# Altium schematic sheet 24V_Main_Regulator.SchDoc (part 2 of 5)
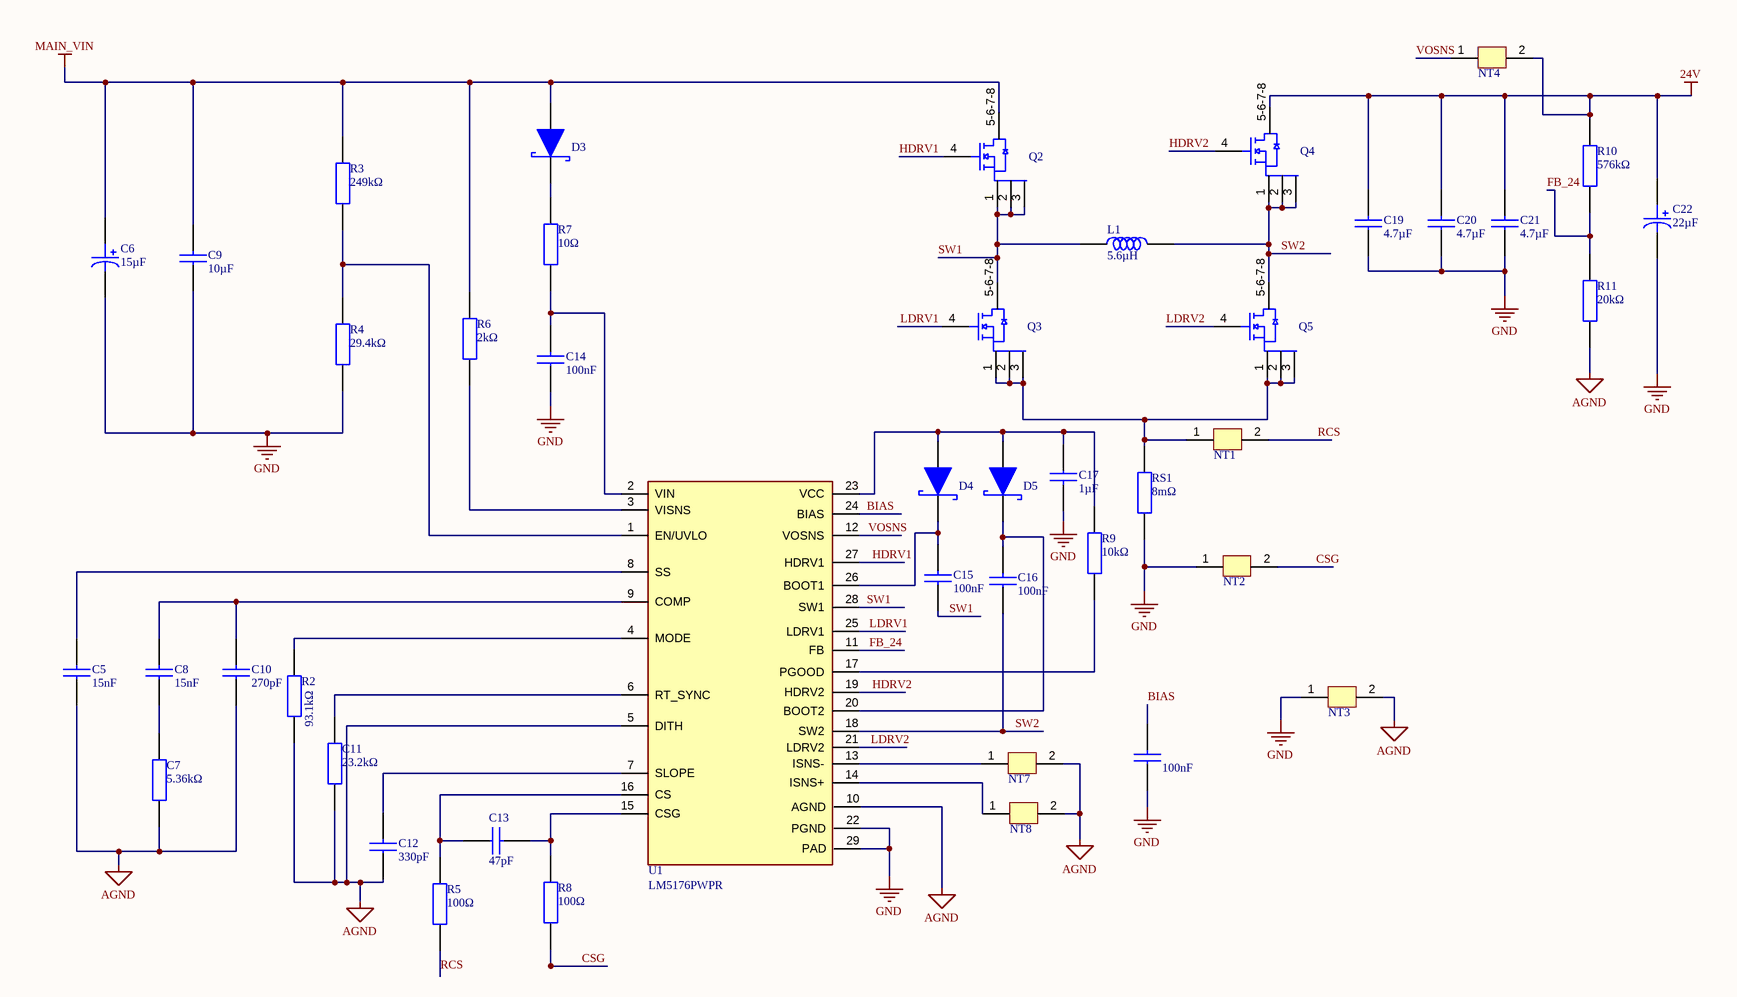
[diagram p1: 24V_Main_Regulator.SchDoc]
## Library data of the parts
C5 = C0603C153J3GACTU: 0603 C 15NF Ceramic Multilayer Capacitor, 25 V, +125DEGC, C0G Dielectric, +/-5%; Manufacturer: Yageo Group; Dissipation Factor: 0.1%; Temperature Coefficient: 30ppm/°C; Tolerance: 5%; Voltage: 25V; Supplier: Farnell; Supplier Part Number: C0603C153J3GACTU; Manufacturer Part Number: C0603C153J3GACTU; RoHS: Compliant; Category: Ceramic Capacitors; Stock: 31000; Pricing: 4000=0,0675 (EUR); Case/Package: 0603; Case Code (Imperial): 0603; Case Code (Metric): 1608; China RoHS: Compliant; Contact Plating: Tin; Country of Origin: Mexico; Depth: 800µm; Dielectric: C0G; Dielectric Material: Ceramic; Export Control Classification Number (ECCN) Code: EAR99; Height: 800µm; Harmonized Tariff Schedule (HTS) Code: 8532.24.00.20; Introduction Date: 2008-06-06; Lead Free: Lead Free; Length: 1.6mm; Lifecycle Status: Production; Material: Ceramic; Max Operating Temperature: 125°C; Min Operating Temperature: -55°C; Mounting Technology: Surface Mount; Pins: 2; Number of Terminals: 2; Packaging: Cut Tape; REACH SVHC: Yes; Schedule B: 8532240020, 8532240020|8532240020, 8532240020|8532240020|8532240020, 8532240020|8532240020|8532240020|8532240020; Termination: SMD/SMT; Thickness: 863.6µm; Voltage Rating: 25V; Voltage Rating (DC): 25V; Width: 800µm; ComponentLink1URL: https://datasheet.octopart.com:443/C0603C153J3GACTU-KEMET-datasheet-178132257.pdf?src-supplier=IHS; ComponentLink1Description: https://datasheet.octopart.com:443/C0603C153J3GACTU-KEMET-datasheet-178132257.pdf?src-supplier=IHS; ComponentLink2URL: https://datasheet.octopart.com:443/C0603C153J3GAC7867-KEMET-datasheet-10540709.pdf?src-supplier=IHS; ComponentLink2Description: https://datasheet.octopart.com:443/C0603C153J3GAC7867-KEMET-datasheet-10540709.pdf?src-supplier=IHS; ComponentLink3URL: https://datasheet.octopart.com:443/C0603C153J3GACTU-KEMET-datasheet-137357764.pdf?src-supplier=Upverter; ComponentLink3Description: https://datasheet.octopart.com:443/C0603C153J3GACTU-KEMET-datasheet-137357764.pdf?src-supplier=Upverter; ComponentLink4URL: https://datasheet.octopart.com:443/C0603C153J3GACTU-KEMET-datasheet-68331921.pdf?src-supplier=Farnell; ComponentLink4Description: https://datasheet.octopart.com:443/C0603C153J3GACTU-KEMET-datasheet-68331921.pdf?src-supplier=Farnell; ComponentLink5URL: https://datasheet.octopart.com:443/C0603C153J3GACTU-KEMET-datasheet-102648314.pdf?src-supplier=Farnell; ComponentLink5Description: https://datasheet.octopart.com:443/C0603C153J3GACTU-KEMET-datasheet-102648314.pdf?src-supplier=Farnell; ComponentLink6URL: https://datasheet.octopart.com:443/C0603C153J3GACTU-Kemet-datasheet-5308203.pdf?src-supplier=Farnell; ComponentLink6Description: https://datasheet.octopart.com:443/C0603C153J3GACTU-Kemet-datasheet-5308203.pdf?src-supplier=Farnell; ComponentLink7URL: https://datasheet.octopart.com:443/C0603C153J3GACTU-KEMET-datasheet-176289261.pdf?src-supplier=element14+APAC; ComponentLink7Description: https://datasheet.octopart.com:443/C0603C153J3GACTU-KEMET-datasheet-176289261.pdf?src-supplier=element14+APAC; ComponentLink8URL: https://datasheet.octopart.com:443/C0603C153J3GACTU-KEMET-datasheet-178087916.pdf?src-supplier=element14+APAC; ComponentLink8Description: https://datasheet.octopart.com:443/C0603C153J3GACTU-KEMET-datasheet-178087916.pdf?src-supplier=element14+APAC; ComponentLink9URL: https://datasheet.octopart.com:443/C0603C153J3GACTU-Kemet-datasheet-66093294.pdf?src-supplier=element14+APAC; ComponentLink9Description: https://datasheet.octopart.com:443/C0603C153J3GACTU-Kemet-datasheet-66093294.pdf?src-supplier=element14+APAC; ComponentLink10URL: https://datasheet.octopart.com:443/C0603C153J3GACTU-Kemet-datasheet-66634713.pdf?src-supplier=element14+APAC; ComponentLink10Description: https://datasheet.octopart.com:443/C0603C153J3GACTU-Kemet-datasheet-66634713.pdf?src-supplier=element14+APAC; ComponentLink11URL: https://datasheet.octopart.com:443/C0603C153J3GACTU-KEMET-datasheet-157246123.pdf?src-supplier=Electro+Sonic; ComponentLink11Description: https://datasheet.octopart.com:443/C0603C153J3GACTU-KEMET-datasheet-157246123.pdf?src-supplier=Electro+Sonic; ComponentLink12URL: https://datasheet.octopart.com:443/C0603C153J3GAC7867-KEMET-datasheet-188512010.pdf?src-supplier=ODG+(Origin+Data+Global); ComponentLink12Description: https://datasheet.octopart.com:443/C0603C153J3GAC7867-KEMET-datasheet-188512010.pdf?src-supplier=ODG+(Origin+Data+Global); ComponentLink13URL: https://datasheet.octopart.com:443/C0603C153J3GACTU-KEMET-datasheet-176142193.pdf?src-supplier=Newark; ComponentLink13Description: https://datasheet.octopart.com:443/C0603C153J3GACTU-KEMET-datasheet-176142193.pdf?src-supplier=Newark; ComponentLink14URL: https://datasheet.octopart.com:443/C0603C153J3GACTU-KEMET-datasheet-101575703.pdf?src-supplier=Newark; ComponentLink14Description: https://datasheet.octopart.com:443/C0603C153J3GACTU-KEMET-datasheet-101575703.pdf?src-supplier=Newark; ComponentLink15URL: https://datasheet.octopart.com:443/C0603C153J3GACTU-Kemet-datasheet-62307647.pdf?src-supplier=Newark; ComponentLink15Description: https://datasheet.octopart.com:443/C0603C153J3GACTU-Kemet-datasheet-62307647.pdf?src-supplier=Newark; ComponentLink16URL: https://datasheet.octopart.com:443/C0603C153J3GACTU-KEMET-datasheet-193515620.pdf?src-supplier=Newark; ComponentLink16Description: https://datasheet.octopart.com:443/C0603C153J3GACTU-KEMET-datasheet-193515620.pdf?src-supplier=Newark; ComponentLink17URL: https://datasheet.octopart.com:443/C0603C153J3GACTU-Kemet-datasheet-67830794.pdf?src-supplier=TME; ComponentLink17Description: https://datasheet.octopart.com:443/C0603C153J3GACTU-Kemet-datasheet-67830794.pdf?src-supplier=TME; ComponentLink18URL: https://datasheet.octopart.com/C0603C153J3GACTU-KEMET-datasheet-84169754.pdf; ComponentLink18Description: https://datasheet.octopart.com/C0603C153J3GACTU-KEMET-datasheet-84169754.pdf; ComponentLink19URL: https://datasheet.octopart.com:443/C0603C153J3GACTU-Kemet-datasheet-60243840.pdf?src-supplier=RS+(Formerly+Allied+Electronics); ComponentLink19Description: https://datasheet.octopart.com:443/C0603C153J3GACTU-Kemet-datasheet-60243840.pdf?src-supplier=RS+(Formerly+Allied+Electronics); ComponentLink20URL: http://sigma.octopart.com:80/conflict_mineral_statement/Yageo-company-3.pdf?src-supplier=Compliance+Statements; ComponentLink20Description: http://sigma.octopart.com:80/conflict_mineral_statement/Yageo-company-3.pdf?src-supplier=Compliance+Statements; ComponentLink21URL: http://sigma.octopart.com:80/rohs_statement/Yageo-company-2.pdf?src-supplier=Compliance+Statements; ComponentLink21Description: http://sigma.octopart.com:80/rohs_statement/Yageo-company-2.pdf?src-supplier=Compliance+Statements
C6 = 100SXV15M: Cap Aluminum 15uF 100V 20% (8 X 11.9mm) Cylindrical 0.04 Ohm 2350mA 5000 hr 105°C T/R; Manufacturer: Panasonic; Manufacturer Lifecycle Status: ACTIVE; Part Series: SXV; ESR (Equivalent Series Resistance): 40mΩ; Leakage Current: 75µA; Life (Hours): 1000hours; Material: Polymer; Polarity: Polar; Ripple Current: 36.5mA; Supplier: Farnell; Supplier Part Number: 100SXV15M; Manufacturer Part Number: 100SXV15M; RoHS: Compliant; Category: Aluminum Electrolytic Capacitors; Pricing: 1=3,85, 10=2,74, 50=2,36, 100=2,09, 200=2,03 (EUR); Case/Package: 3333; Country of Origin: Japan; Diameter: 8mm; Export Control Classification Number (ECCN) Code: EAR99; Height: 11.9mm; Height - Seated (Max): 11.9888mm; Harmonized Tariff Schedule (HTS) Code: 8532.22.00.20; Introduction Date: 2013-06-17; Length: 8.3mm; Lifecycle Status: Production; Max Operating Temperature: 125°C; Min Operating Temperature: -55°C; Mounting Technology: Surface Mount; Number of Terminals: 2; REACH SVHC: Yes; Schedule B: 8532220020, 8532220020|8532220020|8532220020|8532220020|8532220020|8532220020|8532220020|8532220020|8532220020|8532220020|8532220020|8532220020|8532220020|8532220020|8532220020|8532220020|8532220020|8532220020|8532220020|8532220020|8532220020|8532220020|8532220020|85; Tolerance: 20%; Voltage Rating: 100V; Voltage Rating (DC): 100V; Width: 8.3mm; ComponentLink1URL: https://datasheet.octopart.com:443/100SXV15M-Panasonic-datasheet-182100634.pdf?src-supplier=IHS; ComponentLink1Description: https://datasheet.octopart.com:443/100SXV15M-Panasonic-datasheet-182100634.pdf?src-supplier=IHS; ComponentLink2URL: https://sigma.octopart.com:443/138897373/technical_drawing/Panasonic-100SXV15M.pdf?src-supplier=Upverter; ComponentLink2Description: https://sigma.octopart.com:443/138897373/technical_drawing/Panasonic-100SXV15M.pdf?src-supplier=Upverter; ComponentLink3URL: https://datasheet.octopart.com:443/100SXV15M-Panasonic-datasheet-84207363.pdf?src-supplier=Panasonic; ComponentLink3Description: https://datasheet.octopart.com:443/100SXV15M-Panasonic-datasheet-84207363.pdf?src-supplier=Panasonic; ComponentLink4URL: https://datasheet.octopart.com:443/100SXV15M-Panasonic-datasheet-136807604.pdf?src-supplier=Master+Electronics; ComponentLink4Description: https://datasheet.octopart.com:443/100SXV15M-Panasonic-datasheet-136807604.pdf?src-supplier=Master+Electronics; ComponentLink5URL: https://datasheet.octopart.com:443/100SXV15M-Panasonic-datasheet-137287090.pdf?src-supplier=Master+Electronics; ComponentLink5Description: https://datasheet.octopart.com:443/100SXV15M-Panasonic-datasheet-137287090.pdf?src-supplier=Master+Electronics; ComponentLink6URL: https://datasheet.octopart.com:443/100SXV15M-Panasonic-datasheet-98225043.pdf?src-supplier=Farnell; ComponentLink6Description: https://datasheet.octopart.com:443/100SXV15M-Panasonic-datasheet-98225043.pdf?src-supplier=Farnell; ComponentLink7URL: https://datasheet.octopart.com:443/100SXV15M-Panasonic-datasheet-46913357.pdf?src-supplier=Newark; ComponentLink7Description: https://datasheet.octopart.com:443/100SXV15M-Panasonic-datasheet-46913357.pdf?src-supplier=Newark; ComponentLink8URL: https://datasheet.octopart.com:443/100SXV15M-Panasonic-datasheet-78862147.pdf?src-supplier=element14+APAC; ComponentLink8Description: https://datasheet.octopart.com:443/100SXV15M-Panasonic-datasheet-78862147.pdf?src-supplier=element14+APAC; ComponentLink9URL: https://sigma.octopart.com:443/150570690/technical_drawing/Panasonic-100SXV15M.pdf?src-supplier=Panasonic+SCT; ComponentLink9Description: https://sigma.octopart.com:443/150570690/technical_drawing/Panasonic-100SXV15M.pdf?src-supplier=Panasonic+SCT
C7 = CRCW04025K36FKED: Res Thick Film 0402 5.36K Ohm 1% 0.063W(1/16W) ±100ppm/C Pad SMD T/R Automotive AEC-Q200; Manufacturer: Vishay; Max Power Dissipation: 63mW; Temperature Coefficient: 100ppm/°C; Voltage Rating: 50V; Supplier: Farnell; Supplier Part Number: CRCW04025K36FKED; Manufacturer Part Number: CRCW04025K36FKED; RoHS: Compliant; Category: Chip SMD Resistors; Stock: 11400; Pricing: 10=0,02, 100=0,0145, 500=0,0117, 2500=0,0097, 5000=0,0095 (EUR); Case/Package: 0402; Case Code (Imperial): 0402; China RoHS: Non-Compliant; Composition: Thick Film; Contact Plating: Tin; Depth: 500µm; Features: Automotive AEC-Q200; Height: 350µm; Lead Free: Lead Free; Length: 1mm; Lifecycle Status: Production; Max Operating Temperature: 155°C; Military Standard: Not; Min Operating Temperature: -55°C; Mounting Technology: Surface Mount; Pins: 2; Number of Terminals: 2; Number of Terminations: 2; Packaging: Cut Tape; Power Rating: 63mW; Radiation Hardening: No; Ratings: AEC-Q200; REACH SVHC: Yes; Tolerance: 1%; Voltage Rating (DC): 50V; Weight: 652.039032µg; Width: 500µm; Working Voltage: 50V; ComponentLink1URL: https://datasheet.octopart.com:443/CRCW04025K36FKED-Vishay-datasheet-175423584.pdf?src-supplier=IHS; ComponentLink1Description: https://datasheet.octopart.com:443/CRCW04025K36FKED-Vishay-datasheet-175423584.pdf?src-supplier=IHS; ComponentLink2URL: https://datasheet.octopart.com:443/CRCW04025K36FKED.-Vishay-datasheet-83961561.pdf?src-supplier=element14+APAC; ComponentLink2Description: https://datasheet.octopart.com:443/CRCW04025K36FKED.-Vishay-datasheet-83961561.pdf?src-supplier=element14+APAC; ComponentLink3URL: https://datasheet.octopart.com:443/CRCW04025K36FKED-Vishay-datasheet-62317936.pdf?src-supplier=element14+APAC; ComponentLink3Description: https://datasheet.octopart.com:443/CRCW04025K36FKED-Vishay-datasheet-62317936.pdf?src-supplier=element14+APAC; ComponentLink4URL: https://datasheet.octopart.com:443/CRCW04025K36FKED-Vishay-datasheet-14722531.pdf?src-supplier=element14+APAC; ComponentLink4Description: https://datasheet.octopart.com:443/CRCW04025K36FKED-Vishay-datasheet-14722531.pdf?src-supplier=element14+APAC; ComponentLink5URL: https://datasheet.octopart.com:443/CRCW04025K36FKED.-Vishay-datasheet-78776211.pdf?src-supplier=Newark; ComponentLink5Description: https://datasheet.octopart.com:443/CRCW04025K36FKED.-Vishay-datasheet-78776211.pdf?src-supplier=Newark; ComponentLink6URL: https://datasheet.octopart.com:443/CRCW04025K36FKED-Vishay-datasheet-66077789.pdf?src-supplier=Newark; ComponentLink6Description: https://datasheet.octopart.com:443/CRCW04025K36FKED-Vishay-datasheet-66077789.pdf?src-supplier=Newark; ComponentLink7URL: https://datasheet.octopart.com:443/CRCW04025K36FKED-Vishay-datasheet-11761042.pdf?src-supplier=Newark; ComponentLink7Description: https://datasheet.octopart.com:443/CRCW04025K36FKED-Vishay-datasheet-11761042.pdf?src-supplier=Newark; ComponentLink8URL: https://datasheet.octopart.com:443/CRCW04025K36FKED-Vishay-datasheet-11516975.pdf?src-supplier=Newark; ComponentLink8Description: https://datasheet.octopart.com:443/CRCW04025K36FKED-Vishay-datasheet-11516975.pdf?src-supplier=Newark; ComponentLink9URL: https://datasheet.octopart.com:443/CRCW04025K36FKED-Vishay-datasheet-159614168.pdf?src-supplier=Newark; ComponentLink9Description: https://datasheet.octopart.com:443/CRCW04025K36FKED-Vishay-datasheet-159614168.pdf?src-supplier=Newark; ComponentLink10URL: https://datasheet.octopart.com:443/CRCW04025K36FKED-Vishay-datasheet-41302739.pdf?src-supplier=Newark; ComponentLink10Description: https://datasheet.octopart.com:443/CRCW04025K36FKED-Vishay-datasheet-41302739.pdf?src-supplier=Newark; ComponentLink11URL: https://datasheet.octopart.com:443/CRCW04025K36FKED-Vishay-datasheet-62316122.pdf?src-supplier=Future+Electronics; ComponentLink11Description: https://datasheet.octopart.com:443/CRCW04025K36FKED-Vishay-datasheet-62316122.pdf?src-supplier=Future+Electronics; ComponentLink12URL: https://datasheet.octopart.com:443/CRCW04025K36FKED-Vishay-datasheet-5377255.pdf?src-supplier=Garrett; ComponentLink12Description: https://datasheet.octopart.com:443/CRCW04025K36FKED-Vishay-datasheet-5377255.pdf?src-supplier=Garrett; ComponentLink13URL: https://datasheet.octopart.com:443/CRCW04025K36FKED-Vishay-datasheet-148188.pdf?src-supplier=Garrett; ComponentLink13Description: https://datasheet.octopart.com:443/CRCW04025K36FKED-Vishay-datasheet-148188.pdf?src-supplier=Garrett; ComponentLink14URL: https://datasheet.octopart.com:443/CRCW04025K36FKED-Vishay-datasheet-42367.pdf?src-supplier=Garrett; ComponentLink14Description: https://datasheet.octopart.com:443/CRCW04025K36FKED-Vishay-datasheet-42367.pdf?src-supplier=Garrett; ComponentLink15URL: http://sigma.octopart.com:80/rohs_statement/Vishay-company-15.pdf?src-supplier=Compliance+Statements; ComponentLink15Description: http://sigma.octopart.com:80/rohs_statement/Vishay-company-15.pdf?src-supplier=Compliance+Statements
C8 = CGA2B3X7R1H153K050BB: Cap Ceramic 0.015uF 50V X7R 10% Pad SMD 0402 125C Low ESR Automotive T/R; Manufacturer: TDK; Manufacturer Lifecycle Status: PRODUCTION; Supplier: Future Electronics; Supplier Part Number: CGA2B3X7R1H153K050BB; Manufacturer Part Number: CGA2B3X7R1H153K050BB; RoHS: Compliant; Category: Ceramic Capacitors; Stock: 10000; Pricing: 10000=0,0093, 30000=0,009, 40000=0,0089, 100000=0,0087, 150000=0,0085 (USD); Case/Package: 0402; Case Code (Imperial): 0402; Case Code (Metric): 1005; China RoHS: Compliant; Composition: Ceramic; Country of Origin: Japan; Depth: 500µm; Dielectric: X7R; Dielectric Material: Ceramic; Export Control Classification Number (ECCN) Code: EAR99; Height: 500µm; Harmonized Tariff Schedule (HTS) Code: 8532.24.00.20; Introduction Date: 2012-12-22; Length: 1mm; Lifecycle Status: Production; Material: Ceramic; Max Length: 1.05mm; Max Operating Temperature: 125°C; Max Width: 550µm; Min Length: 950µm; Min Operating Temperature: -55°C; Min Width: 450µm; Mounting Technology: Surface Mount; Number of Terminals: 2; Ratings: AEC-Q200; REACH SVHC: Yes; Schedule B: 8532240020, 8532240020|8532240020|8532240020|8532240020|8532240020; Termination: SMD/SMT; Thickness: 558.8µm; Tolerance: 10%; Voltage Rating: 50V; Voltage Rating (DC): 50V; Weight: 652.039032µg; Width: 500µm; ComponentLink1URL: https://datasheet.octopart.com:443/CGA2B3X7R1H153K050BB-TDK-datasheet-165583812.pdf?src-supplier=IHS; ComponentLink1Description: https://datasheet.octopart.com:443/CGA2B3X7R1H153K050BB-TDK-datasheet-165583812.pdf?src-supplier=IHS; ComponentLink2URL: https://datasheet.octopart.com:443/CGA2B3X7R1H153K050BB-TDK-datasheet-138890726.pdf?src-supplier=Upverter; ComponentLink2Description: https://datasheet.octopart.com:443/CGA2B3X7R1H153K050BB-TDK-datasheet-138890726.pdf?src-supplier=Upverter; ComponentLink3URL: https://datasheet.octopart.com:443/CGA2B3X7R1H153K050BB-TDK-datasheet-151546526.pdf?src-supplier=TDK; ComponentLink3Description: https://datasheet.octopart.com:443/CGA2B3X7R1H153K050BB-TDK-datasheet-151546526.pdf?src-supplier=TDK; ComponentLink4URL: https://datasheet.octopart.com:443/CGA2B3X7R1H153K050BB-TDK-datasheet-43366117.pdf?src-supplier=Newark; ComponentLink4Description: https://datasheet.octopart.com:443/CGA2B3X7R1H153K050BB-TDK-datasheet-43366117.pdf?src-supplier=Newark; ComponentLink5URL: https://datasheet.octopart.com:443/CGA2B3X7R1H153K050BB-TDK-datasheet-33009218.pdf?src-supplier=Newark; ComponentLink5Description: https://datasheet.octopart.com:443/CGA2B3X7R1H153K050BB-TDK-datasheet-33009218.pdf?src-supplier=Newark; ComponentLink6URL: https://datasheet.octopart.com:443/CGA2B3X7R1H153K050BB-TDK-datasheet-13376850.pdf?src-supplier=Newark; ComponentLink6Description: https://datasheet.octopart.com:443/CGA2B3X7R1H153K050BB-TDK-datasheet-13376850.pdf?src-supplier=Newark; ComponentLink7URL: https://datasheet.octopart.com:443/CGA2B3X7R1H153K050BB-TDK-datasheet-12542526.pdf?src-supplier=Newark; ComponentLink7Description: https://datasheet.octopart.com:443/CGA2B3X7R1H153K050BB-TDK-datasheet-12542526.pdf?src-supplier=Newark; ComponentLink8URL: https://datasheet.octopart.com:443/CGA2B3X7R1H153K050BB-TDK-datasheet-140571036.pdf?src-supplier=Arrow.cn; ComponentLink8Description: https://datasheet.octopart.com:443/CGA2B3X7R1H153K050BB-TDK-datasheet-140571036.pdf?src-supplier=Arrow.cn
C9 = C5750X7S2A106M230KB: Multilayer Ceramic Capacitor, C Series, 10 - F, - 20%, X7S, 100 V, 2220 [5650 Metric]; Manufacturer: TDK; Manufacturer Lifecycle Status: PRODUCTION (NOT RECOMMENDED FOR NEW DESIGN); Voltage: 100V; Supplier: Future Electronics; Supplier Part Number: C5750X7S2A106M230KB; Manufacturer Part Number: C5750X7S2A106M230KB; RoHS: Compliant; Category: Ceramic Capacitors; Stock: 30000; Pricing: 500=0,88, 1000=0,865, 1500=0,86, 2000=0,85 (USD); Case/Package: 2220; Case Code (Imperial): 2220; Case Code (Metric): 5750; China RoHS: Compliant; Composition: Ceramic; Depth: 5mm; Dielectric: X7S; Dielectric Material: Ceramic; Height: 2.3mm; Lead Free: Lead Free; Length: 5.7mm; Lifecycle Status: NRND; Material: Ceramic; Max Length: 6.1mm; Max Operating Temperature: 125°C; Max Width: 5.4mm; Min Length: 5.3mm; Min Operating Temperature: -55°C; Min Width: 4.6mm; Mounting Technology: Surface Mount; Pins: 2; Number of Terminals: 2; REACH SVHC: Yes; Schedule B: 8532240020, 8532240020|8532240020|8532240020|8532240020|8532240020; Termination: SMD/SMT; Thickness: 2.4892mm; Tolerance: 20%; Voltage Rating: 100V; Voltage Rating (DC): 100V; Weight: 480.014126mg; Width: 5mm; ComponentLink1URL: https://datasheet.octopart.com:443/C5750X7S2A106M230KB-TDK-datasheet-159617022.pdf?src-supplier=IHS; ComponentLink1Description: https://datasheet.octopart.com:443/C5750X7S2A106M230KB-TDK-datasheet-159617022.pdf?src-supplier=IHS; ComponentLink2URL: https://datasheet.octopart.com:443/C5750X7S2A106M230KB-TDK-datasheet-151546522.pdf?src-supplier=TDK; ComponentLink2Description: https://datasheet.octopart.com:443/C5750X7S2A106M230KB-TDK-datasheet-151546522.pdf?src-supplier=TDK; ComponentLink3URL: https://datasheet.octopart.com:443/C5750X7S2A106M230KB-TDK-datasheet-43914167.pdf?src-supplier=Newark; ComponentLink3Description: https://datasheet.octopart.com:443/C5750X7S2A106M230KB-TDK-datasheet-43914167.pdf?src-supplier=Newark; ComponentLink4URL: https://datasheet.octopart.com:443/C5750X7S2A106M230KB-TDK-datasheet-15070070.pdf?src-supplier=Newark; ComponentLink4Description: https://datasheet.octopart.com:443/C5750X7S2A106M230KB-TDK-datasheet-15070070.pdf?src-supplier=Newark; ComponentLink5URL: https://datasheet.octopart.com:443/C5750X7S2A106M230KB-TDK-datasheet-41194876.pdf?src-supplier=Newark; ComponentLink5Description: https://datasheet.octopart.com:443/C5750X7S2A106M230KB-TDK-datasheet-41194876.pdf?src-supplier=Newark; ComponentLink6URL: https://datasheet.octopart.com:443/C5750X7S2A106M230KB-TDK-datasheet-154543791.pdf?src-supplier=ODG+(Origin+Data+Global); ComponentLink6Description: https://datasheet.octopart.com:443/C5750X7S2A106M230KB-TDK-datasheet-154543791.pdf?src-supplier=ODG+(Origin+Data+Global); ComponentLink7URL: https://datasheet.octopart.com:443/C5750X7S2A106M230KB-TDK-datasheet-13376850.pdf?src-supplier=Farnell; ComponentLink7Description: https://datasheet.octopart.com:443/C5750X7S2A106M230KB-TDK-datasheet-13376850.pdf?src-supplier=Farnell; ComponentLink8URL: https://datasheet.octopart.com:443/C5750X7S2A106M230KB-TDK-datasheet-11980753.pdf?src-supplier=Farnell; ComponentLink8Description: https://datasheet.octopart.com:443/C5750X7S2A106M230KB-TDK-datasheet-11980753.pdf?src-supplier=Farnell; ComponentLink9URL: https://datasheet.octopart.com:443/C5750X7S2A106M-TDK-datasheet-11517535.pdf?src-supplier=Farnell; ComponentLink9Description: https://datasheet.octopart.com:443/C5750X7S2A106M-TDK-datasheet-11517535.pdf?src-supplier=Farnell; ComponentLink10URL: https://datasheet.octopart.com:443/C5750X7S2A106M-TDK-datasheet-8852320.pdf?src-supplier=Farnell; ComponentLink10Description: https://datasheet.octopart.com:443/C5750X7S2A106M-TDK-datasheet-8852320.pdf?src-supplier=Farnell; ComponentLink11URL: https://datasheet.octopart.com:443/C5750X7S2A106M230KB-TDK-datasheet-12514252.pdf?src-supplier=Future+Electronics; ComponentLink11Description: https://datasheet.octopart.com:443/C5750X7S2A106M230KB-TDK-datasheet-12514252.pdf?src-supplier=Future+Electronics; ComponentLink12URL: https://datasheet.octopart.com:443/C5750X7S2A106M230KB-TDK-datasheet-8853194.pdf?src-supplier=Future+Electronics; ComponentLink12Description: https://datasheet.octopart.com:443/C5750X7S2A106M230KB-TDK-datasheet-8853194.pdf?src-supplier=Future+Electronics; ComponentLink13URL: https://datasheet.octopart.com:443/C5750X7S2A106M-TDK-datasheet-11775989.pdf?src-supplier=Factory+Futures; ComponentLink13Description: https://datasheet.octopart.com:443/C5750X7S2A106M-TDK-datasheet-11775989.pdf?src-supplier=Factory+Futures
C10 = CL21C271JBANNNC: 50V 270pF C0G 卤5% 0805 Multilayer Ceramic Capacitors MLCC - SMD/SMT ROHS; Manufacturer: Samsung Electro-Mechanics; Temperature Coefficient: 30ppm/°C; Tolerance: 5%; Supplier: Arrow Electronics; Supplier Part Number: CL21C271JBANNNC; Manufacturer Part Number: CL21C271JBANNNC; RoHS: Compliant; Category: Ceramic Capacitors; Stock: 1188000; Pricing: 20000=0,0056, 400000=0,0053 (USD); Case/Package: 0805; Case Code (Imperial): 0805; Case Code (Metric): 2012; China RoHS: Compliant; Depth: 1.25mm; Dielectric: C0G; Dielectric Material: Ceramic; Height: 750µm; Lead Free: Lead Free; Length: 2mm; Lifecycle Status: Production; Material: Ceramic; Max Operating Temperature: 125°C; Min Operating Temperature: -55°C; Mounting Technology: Surface Mount; Number of Terminals: 2; Radiation Hardening: No; REACH SVHC: Yes; Schedule B: 8532240020, 8532240020|8532240020, 8532240020|8532240020|8532240020, 8532240020|8532240020|8532240020|8532240020; Thickness: 762µm; Voltage: 50V; Voltage Rating: 50V; Voltage Rating (DC): 50V; Width: 1.25mm; ComponentLink1URL: https://datasheet.octopart.com:443/CL21C271JBANNNC-Samsung-Electro-Mechanics-datasheet-136482566.pdf?src-supplier=IHS; ComponentLink1Description: https://datasheet.octopart.com:443/CL21C271JBANNNC-Samsung-Electro-Mechanics-datasheet-136482566.pdf?src-supplier=IHS; ComponentLink2URL: https://datasheet.octopart.com/CL21C271JBANNNC-Samsung-Electro-Mechanics-datasheet-8324245.pdf; ComponentLink2Description: https://datasheet.octopart.com/CL21C271JBANNNC-Samsung-Electro-Mechanics-datasheet-8324245.pdf; ComponentLink3URL: https://datasheet.octopart.com/CL21C271JBANNNC-Samsung-Electro-Mechanics-datasheet-97040617.pdf; ComponentLink3Description: https://datasheet.octopart.com/CL21C271JBANNNC-Samsung-Electro-Mechanics-datasheet-97040617.pdf; ComponentLink4URL: https://datasheet.octopart.com/General-Multilayer-Ceramic-Capacitors-Samsung-datasheet-family-111.pdf; ComponentLink4Description: https://datasheet.octopart.com/General-Multilayer-Ceramic-Capacitors-Samsung-datasheet-family-111.pdf; ComponentLink5URL: https://datasheet.octopart.com:443/CL21C271JBANNNC-Samsung-Electro-Mechanics-datasheet-149046238.pdf?src-supplier=Future+Electronics; ComponentLink5Description: https://datasheet.octopart.com:443/CL21C271JBANNNC-Samsung-Electro-Mechanics-datasheet-149046238.pdf?src-supplier=Future+Electronics; ComponentLink6URL: https://datasheet.octopart.com:443/CL21C271JBANNNC-Samsung-Electro-Mechanics-datasheet-110334111.pdf?src-supplier=Future+Electronics; ComponentLink6Description: https://datasheet.octopart.com:443/CL21C271JBANNNC-Samsung-Electro-Mechanics-datasheet-110334111.pdf?src-supplier=Future+Electronics; ComponentLink7URL: https://datasheet.octopart.com:443/CL21C271JBANNNC-Samsung-Electro-Mechanics-datasheet-81462340.pdf?src-supplier=Future+Electronics; ComponentLink7Description: https://datasheet.octopart.com:443/CL21C271JBANNNC-Samsung-Electro-Mechanics-datasheet-81462340.pdf?src-supplier=Future+Electronics; ComponentLink8URL: https://datasheet.octopart.com:443/CL21C271JBANNNC-Samsung-datasheet-48647796.pdf?src-supplier=Future+Electronics; ComponentLink8Description: https://datasheet.octopart.com:443/CL21C271JBANNNC-Samsung-datasheet-48647796.pdf?src-supplier=Future+Electronics; ComponentLink9URL: https://datasheet.octopart.com:443/CL21C271JBANNNC-Samsung-datasheet-26669409.pdf?src-supplier=Future+Electronics; ComponentLink9Description: https://datasheet.octopart.com:443/CL21C271JBANNNC-Samsung-datasheet-26669409.pdf?src-supplier=Future+Electronics; ComponentLink10URL: https://datasheet.octopart.com:443/CL21C271JBANNNC-Samsung-datasheet-8326407.pdf?src-supplier=TME; ComponentLink10Description: https://datasheet.octopart.com:443/CL21C271JBANNNC-Samsung-datasheet-8326407.pdf?src-supplier=TME; ComponentLink11URL: https://datasheet.octopart.com:443/CL21C271JBANNNC-Samsung-Electro-Mechanics-datasheet-11541288.pdf?src-supplier=Arrow+Electronics; ComponentLink11Description: https://datasheet.octopart.com:443/CL21C271JBANNNC-Samsung-Electro-Mechanics-datasheet-11541288.pdf?src-supplier=Arrow+Electronics; ComponentLink12URL: http://sigma.octopart.com:80/rohs_certificate/General-Multilayer-Ceramic-Capacitors-Samsung-family-110.pdf?src-supplier=Compliance+Statements; ComponentLink12Description: http://sigma.octopart.com:80/rohs_certificate/General-Multilayer-Ceramic-Capacitors-Samsung-family-110.pdf?src-supplier=Compliance+Statements; ComponentLink13URL: http://sigma.octopart.com:80/rohs_statement/General-Multilayer-Ceramic-Capacitors-Samsung-family-132.pdf?src-supplier=Compliance+Statements; ComponentLink13Description: http://sigma.octopart.com:80/rohs_statement/General-Multilayer-Ceramic-Capacitors-Samsung-family-132.pdf?src-supplier=Compliance+Statements; ComponentLink14URL: http://sigma.octopart.com:80/reach_statement/General-Multilayer-Ceramic-Capacitors-Samsung-family-133.pdf?src-supplier=Compliance+Statements; ComponentLink14Description: http://sigma.octopart.com:80/reach_statement/General-Multilayer-Ceramic-Capacitors-Samsung-family-133.pdf?src-supplier=Compliance+Statements
C11 = CRCW040223K2FKED: Res Thick Film 0402 23.2K Ohm 1% 1/16W ±100ppm/°C Molded SMD Paper T/R; Manufacturer: Vishay; Max Power Dissipation: 63mW; Voltage Rating: 50V; Supplier: Farnell; Supplier Part Number: CRCW040223K2FKED; Manufacturer Part Number: CRCW040223K2FKED; RoHS: Compliant; Category: Chip SMD Resistors; Stock: 20000; Pricing: 10000=0,009 (EUR); Case/Package: 0402; Case Code (Imperial): 0402; China RoHS: Non-Compliant; Composition: Thick Film; Contact Plating: Tin; Country of Origin: Israel, Taiwan; Depth: 500µm; Export Control Classification Number (ECCN) Code: EAR99; Features: Automotive AEC-Q200; Height: 350µm; Harmonized Tariff Schedule (HTS) Code: 8533.21.00.30; Introduction Date: 2005-03-24; Lead Free: Lead Free; Length: 1mm; Lifecycle Status: Production; Max Operating Temperature: 155°C; Military Standard: Not; Min Operating Temperature: -55°C; Mounting Technology: Surface Mount; Pins: 2; Number of Terminals: 2; Number of Terminations: 2; Packaging: Cut Tape; Power Rating: 63mW; Radiation Hardening: No; Ratings: AEC-Q200; REACH SVHC: Yes; Schedule B: 8533210045; Temperature Coefficient: 100ppm/°C; Termination: SMD/SMT; Tolerance: 1%; Voltage Rating (DC): 50V; Weight: 652.039032µg; Width: 500µm; Working Voltage: 50V; ComponentLink1URL: https://datasheet.octopart.com:443/CRCW040223K2FKED-Vishay-datasheet-175423584.pdf?src-supplier=IHS; ComponentLink1Description: https://datasheet.octopart.com:443/CRCW040223K2FKED-Vishay-datasheet-175423584.pdf?src-supplier=IHS; ComponentLink2URL: https://datasheet.octopart.com:443/CRCW040223K2FKED-Vishay-datasheet-190005712.pdf?src-supplier=TME; ComponentLink2Description: https://datasheet.octopart.com:443/CRCW040223K2FKED-Vishay-datasheet-190005712.pdf?src-supplier=TME; ComponentLink3URL: https://datasheet.octopart.com:443/CRCW040223K2FKED.-Vishay-datasheet-83961561.pdf?src-supplier=element14+APAC; ComponentLink3Description: https://datasheet.octopart.com:443/CRCW040223K2FKED.-Vishay-datasheet-83961561.pdf?src-supplier=element14+APAC; ComponentLink4URL: https://datasheet.octopart.com:443/CRCW040223K2FKED-Vishay-datasheet-66077789.pdf?src-supplier=element14+APAC; ComponentLink4Description: https://datasheet.octopart.com:443/CRCW040223K2FKED-Vishay-datasheet-66077789.pdf?src-supplier=element14+APAC; ComponentLink5URL: https://datasheet.octopart.com:443/CRCW040223K2FKED-Vishay-datasheet-62317933.pdf?src-supplier=element14+APAC; ComponentLink5Description: https://datasheet.octopart.com:443/CRCW040223K2FKED-Vishay-datasheet-62317933.pdf?src-supplier=element14+APAC; ComponentLink6URL: https://datasheet.octopart.com:443/CRCW040223K2FKED-Vishay-datasheet-14722531.pdf?src-supplier=element14+APAC; ComponentLink6Description: https://datasheet.octopart.com:443/CRCW040223K2FKED-Vishay-datasheet-14722531.pdf?src-supplier=element14+APAC; ComponentLink7URL: https://datasheet.octopart.com:443/CRCW040223K2FKED.-Vishay-datasheet-78776209.pdf?src-supplier=Newark; ComponentLink7Description: https://datasheet.octopart.com:443/CRCW040223K2FKED.-Vishay-datasheet-78776209.pdf?src-supplier=Newark; ComponentLink8URL: https://datasheet.octopart.com:443/CRCW040223K2FKED-Vishay-datasheet-11761042.pdf?src-supplier=Newark; ComponentLink8Description: https://datasheet.octopart.com:443/CRCW040223K2FKED-Vishay-datasheet-11761042.pdf?src-supplier=Newark; ComponentLink9URL: https://datasheet.octopart.com:443/CRCW040223K2FKED-Vishay-datasheet-159614168.pdf?src-supplier=Newark; ComponentLink9Description: https://datasheet.octopart.com:443/CRCW040223K2FKED-Vishay-datasheet-159614168.pdf?src-supplier=Newark; ComponentLink10URL: https://datasheet.octopart.com:443/CRCW040223K2FKED-Vishay-datasheet-33013972.pdf?src-supplier=Newark; ComponentLink10Description: https://datasheet.octopart.com:443/CRCW040223K2FKED-Vishay-datasheet-33013972.pdf?src-supplier=Newark; ComponentLink11URL: https://datasheet.octopart.com:443/CRCW040223K2FKED-Vishay-datasheet-21268114.pdf?src-supplier=Newark; ComponentLink11Description: https://datasheet.octopart.com:443/CRCW040223K2FKED-Vishay-datasheet-21268114.pdf?src-supplier=Newark; ComponentLink12URL: https://datasheet.octopart.com:443/CRCW040223K2FKED-Vishay-datasheet-21226360.pdf?src-supplier=Newark; ComponentLink12Description: https://datasheet.octopart.com:443/CRCW040223K2FKED-Vishay-datasheet-21226360.pdf?src-supplier=Newark; ComponentLink13URL: https://datasheet.octopart.com:443/CRCW040223K2FKED-Vishay-datasheet-62316122.pdf?src-supplier=Future+Electronics; ComponentLink13Description: https://datasheet.octopart.com:443/CRCW040223K2FKED-Vishay-datasheet-62316122.pdf?src-supplier=Future+Electronics; ComponentLink14URL: https://datasheet.octopart.com:443/CRCW040223K2FKED-Vishay-datasheet-12509741.pdf?src-supplier=Future+Electronics; ComponentLink14Description: https://datasheet.octopart.com:443/CRCW040223K2FKED-Vishay-datasheet-12509741.pdf?src-supplier=Future+Electronics; ComponentLink15URL: https://datasheet.octopart.com:443/CRCW040223K2FKED-Vishay-Dale-datasheet-47688880.pdf?src-supplier=RS+(Formerly+Allied+Electronics); ComponentLink15Description: https://datasheet.octopart.com:443/CRCW040223K2FKED-Vishay-Dale-datasheet-47688880.pdf?src-supplier=RS+(Formerly+Allied+Electronics); ComponentLink16URL: https://datasheet.octopart.com:443/CRCW040223K2FKED-Vishay-datasheet-12001583.pdf?src-supplier=RS+(Formerly+Allied+Electronics); ComponentLink16Description: https://datasheet.octopart.com:443/CRCW040223K2FKED-Vishay-datasheet-12001583.pdf?src-supplier=RS+(Formerly+Allied+Electronics); ComponentLink17URL: https://datasheet.octopart.com:443/CRCW040223K2FKED-Vishay-datasheet-5306405.pdf?src-supplier=RS+(Formerly+Allied+Electronics); ComponentLink17Description: https://datasheet.octopart.com:443/CRCW040223K2FKED-Vishay-datasheet-5306405.pdf?src-supplier=RS+(Formerly+Allied+Electronics); ComponentLink18URL: https://datasheet.octopart.com:443/CRCW040223K2FKED-Vishay-datasheet-11516975.pdf?src-supplier=Farnell; ComponentLink18Description: https://datasheet.octopart.com:443/CRCW040223K2FKED-Vishay-datasheet-11516975.pdf?src-supplier=Farnell; ComponentLink19URL: https://datasheet.octopart.com:443/CRCW040223K2FKED-Vishay-datasheet-512477.pdf?src-supplier=Farnell; ComponentLink19Description: https://datasheet.octopart.com:443/CRCW040223K2FKED-Vishay-datasheet-512477.pdf?src-supplier=Farnell; ComponentLink20URL: https://datasheet.octopart.com:443/CRCW040223K2FKED-Vishay-datasheet-11540273.pdf?src-supplier=Arrow+Electronics; ComponentLink20Description: https://datasheet.octopart.com:443/CRCW040223K2FKED-Vishay-datasheet-11540273.pdf?src-supplier=Arrow+Electronics; ComponentLink21URL: https://datasheet.octopart.com:443/CRCW040223K2FKED-Vishay-datasheet-8445837.pdf?src-supplier=element14; ComponentLink21Description: https://datasheet.octopart.com:443/CRCW040223K2FKED-Vishay-datasheet-8445837.pdf?src-supplier=element14; ComponentLink22URL: https://datasheet.octopart.com:443/CRCW040223K2FKED-Vishay-datasheet-5377255.pdf?src-supplier=Garrett; ComponentLink22Description: https://datasheet.octopart.com:443/CRCW040223K2FKED-Vishay-datasheet-5377255.pdf?src-supplier=Garrett; ComponentLink23URL: https://datasheet.octopart.com:443/CRCW040223K2FKED-Vishay-datasheet-148188.pdf?src-supplier=Garrett; ComponentLink23Description: https://datasheet.octopart.com:443/CRCW040223K2FKED-Vishay-datasheet-148188.pdf?src-supplier=Garrett; ComponentLink24URL: https://datasheet.octopart.com:443/CRCW040223K2FKED-Vishay-datasheet-42367.pdf?src-supplier=Garrett; ComponentLink24Description: https://datasheet.octopart.com:443/CRCW040223K2FKED-Vishay-datasheet-42367.pdf?src-supplier=Garrett; ComponentLink25URL: http://sigma.octopart.com:80/rohs_statement/Vishay-company-15.pdf?src-supplier=Compliance+Statements; ComponentLink25Description: http://sigma.octopart.com:80/rohs_statement/Vishay-company-15.pdf?src-supplier=Compliance+Statements
C12 = CL10C331JB8NNNC: 50V 330pF C0G 卤5% 0603 Multilayer Ceramic Capacitors MLCC - SMD/SMT ROHS; Manufacturer: Samsung Electro-Mechanics; Temperature Coefficient: 30ppm/°C; Tolerance: 5%; Supplier: Future Electronics; Supplier Part Number: CL10C331JB8NNNC; Manufacturer Part Number: CL10C331JB8NNNC; RoHS: Compliant; Category: Ceramic Capacitors; Stock: 512000; Pricing: 8000=0,004, 20000=0,0039, 80000=0,0037, 120000=0,0037, 300000=0,0035 (USD); Case/Package: 0603; Case Code (Imperial): 0603; Case Code (Metric): 1608; China RoHS: Compliant; Depth: 800µm; Dielectric: C0G; Dielectric Material: Ceramic; Height: 900µm; Lead Free: Lead Free; Length: 1.6mm; Lifecycle Status: Production; Material: Ceramic; Max Operating Temperature: 125°C; Min Operating Temperature: -55°C; Mounting Technology: Surface Mount; Number of Terminals: 2; Radiation Hardening: No; REACH SVHC: Yes; Schedule B: 8532240020, 8532240020|8532240020, 8532240020|8532240020|8532240020, 8532240020|8532240020|8532240020|8532240020; Thickness: 889µm; Voltage: 50V; Voltage Rating: 50V; Voltage Rating (DC): 50V; Width: 800µm; ComponentLink1URL: https://datasheet.octopart.com:443/CL10C331JB8NNNC-Samsung-Electro-Mechanics-datasheet-136482428.pdf?src-supplier=Newark; ComponentLink1Description: https://datasheet.octopart.com:443/CL10C331JB8NNNC-Samsung-Electro-Mechanics-datasheet-136482428.pdf?src-supplier=Newark; ComponentLink2URL: https://datasheet.octopart.com:443/CL10C331JB8NNNC-Samsung-Electro-Mechanics-datasheet-136533356.pdf?src-supplier=Newark; ComponentLink2Description: https://datasheet.octopart.com:443/CL10C331JB8NNNC-Samsung-Electro-Mechanics-datasheet-136533356.pdf?src-supplier=Newark; ComponentLink3URL: https://datasheet.octopart.com/CL10C331JB8NNNC-Samsung-Electro-Mechanics-datasheet-8324245.pdf; ComponentLink3Description: https://datasheet.octopart.com/CL10C331JB8NNNC-Samsung-Electro-Mechanics-datasheet-8324245.pdf; ComponentLink4URL: https://datasheet.octopart.com/CL10C331JB8NNNC-Samsung-Electro-Mechanics-datasheet-97040617.pdf; ComponentLink4Description: https://datasheet.octopart.com/CL10C331JB8NNNC-Samsung-Electro-Mechanics-datasheet-97040617.pdf; ComponentLink5URL: https://datasheet.octopart.com:443/CL10C331JB8NNNC-Samsung-Electro-Mechanics-datasheet-110226367.pdf?src-supplier=Future+Electronics; ComponentLink5Description: https://datasheet.octopart.com:443/CL10C331JB8NNNC-Samsung-Electro-Mechanics-datasheet-110226367.pdf?src-supplier=Future+Electronics; ComponentLink6URL: https://datasheet.octopart.com:443/CL10C331JB8NNNC-Samsung-Electro-Mechanics-datasheet-81462034.pdf?src-supplier=Future+Electronics; ComponentLink6Description: https://datasheet.octopart.com:443/CL10C331JB8NNNC-Samsung-Electro-Mechanics-datasheet-81462034.pdf?src-supplier=Future+Electronics; ComponentLink7URL: https://datasheet.octopart.com:443/CL10C331JB8NNNC-Samsung-datasheet-42280642.pdf?src-supplier=Future+Electronics; ComponentLink7Description: https://datasheet.octopart.com:443/CL10C331JB8NNNC-Samsung-datasheet-42280642.pdf?src-supplier=Future+Electronics; ComponentLink8URL: https://datasheet.octopart.com:443/CL10C331JB8NNNC-Samsung-datasheet-26669171.pdf?src-supplier=Future+Electronics; ComponentLink8Description: https://datasheet.octopart.com:443/CL10C331JB8NNNC-Samsung-datasheet-26669171.pdf?src-supplier=Future+Electronics; ComponentLink9URL: https://datasheet.octopart.com:443/CL10C331JB8NNNC-Samsung-datasheet-8326407.pdf?src-supplier=TME; ComponentLink9Description: https://datasheet.octopart.com:443/CL10C331JB8NNNC-Samsung-datasheet-8326407.pdf?src-supplier=TME; ComponentLink10URL: https://datasheet.octopart.com:443/CL10C331JB8NNNC-Samsung-Electro-Mechanics-datasheet-11541288.pdf?src-supplier=Arrow+Electronics; ComponentLink10Description: https://datasheet.octopart.com:443/CL10C331JB8NNNC-Samsung-Electro-Mechanics-datasheet-11541288.pdf?src-supplier=Arrow+Electronics
C13 = 06035A470JAT2A: 50V 47pF C0G ±5% 0603 Multilayer Ceramic Capacitors MLCC - SMD/SMT ROHS; Manufacturer: KYOCERA AVX; Temperature Coefficient: 30ppm/°C; Supplier: Future Electronics; Supplier Part Number: 06035A470JAT2A; Manufacturer Part Number: 06035A470JAT2A; RoHS: Compliant; Category: Ceramic Capacitors; Stock: 1052000; Pricing: 4000=0,0061, 16000=0,0059, 60000=0,0057, 160000=0,0056, 400000=0,0053 (USD); Case/Package: 0603; Case Code (Imperial): 0603; China RoHS: Compliant; Contact Plating: Tin; Depth: 810µm; Dielectric: C0G; Dielectric Material: Ceramic; Export Control Classification Number (ECCN) Code: EAR99; Height: 900µm; Harmonized Tariff Schedule (HTS) Code: 8532.24.00.20; Introduction Date: 1996-08-01; Lead Free: Lead Free; Length: 1.6mm; Lifecycle Status: Production; Material: Ceramic; Max Operating Temperature: 125°C; Min Operating Temperature: -55°C; Mounting Technology: Surface Mount; Pins: 2; Number of Terminals: 2; Packaging: Cut Tape; Radiation Hardening: No; REACH SVHC: Yes; Schedule B: 8532240020; Termination: SMD/SMT; Thickness: 864µm; Tolerance: 5%; Voltage: 50V; Voltage Rating: 50V; Voltage Rating (AC): 50V; Voltage Rating (DC): 50V; Width: 810µm; ComponentLink1URL: https://datasheet.octopart.com:443/06035A470JAT2A-KYOCERA-AVX-datasheet-169278450.pdf?src-supplier=IHS; ComponentLink1Description: https://datasheet.octopart.com:443/06035A470JAT2A-KYOCERA-AVX-datasheet-169278450.pdf?src-supplier=IHS; ComponentLink2URL: https://sigma.octopart.com:443/147443767/technical_drawing/AVX-06035A470JAT2A.pdf?src-supplier=Upverter; ComponentLink2Description: https://sigma.octopart.com:443/147443767/technical_drawing/AVX-06035A470JAT2A.pdf?src-supplier=Upverter; ComponentLink3URL: https://datasheet.octopart.com:443/06035A470JAT2A-AVX-datasheet-9883399.pdf?src-supplier=Newark; ComponentLink3Description: https://datasheet.octopart.com:443/06035A470JAT2A-AVX-datasheet-9883399.pdf?src-supplier=Newark; ComponentLink4URL: https://datasheet.octopart.com:443/06035A470JAT2A-AVX-datasheet-118583.pdf?src-supplier=Newark; ComponentLink4Description: https://datasheet.octopart.com:443/06035A470JAT2A-AVX-datasheet-118583.pdf?src-supplier=Newark; ComponentLink5URL: https://datasheet.octopart.com:443/06035A470JAT2A-KYOCERA-AVX-datasheet-65568165.pdf?src-supplier=Newark; ComponentLink5Description: https://datasheet.octopart.com:443/06035A470JAT2A-KYOCERA-AVX-datasheet-65568165.pdf?src-supplier=Newark; ComponentLink6URL: https://datasheet.octopart.com:443/06035A470JAT2A-KYOCERA-AVX-datasheet-156093840.pdf?src-supplier=element14+APAC; ComponentLink6Description: https://datasheet.octopart.com:443/06035A470JAT2A-KYOCERA-AVX-datasheet-156093840.pdf?src-supplier=element14+APAC; ComponentLink7URL: https://datasheet.octopart.com:443/06035A470JAT2A-KYOCERA-AVX-datasheet-50865065.pdf?src-supplier=HQonline; ComponentLink7Description: https://datasheet.octopart.com:443/06035A470JAT2A-KYOCERA-AVX-datasheet-50865065.pdf?src-supplier=HQonline; ComponentLink8URL: https://datasheet.octopart.com:443/06035A470JAT2A-AVX-datasheet-5313633.pdf?src-supplier=_legacy+Avnet; ComponentLink8Description: https://datasheet.octopart.com:443/06035A470JAT2A-AVX-datasheet-5313633.pdf?src-supplier=_legacy+Avnet; ComponentLink9URL: https://datasheet.octopart.com:443/06035A470JAT2A-AVX-datasheet-8398952.pdf?src-supplier=_legacy+Avnet; ComponentLink9Description: https://datasheet.octopart.com:443/06035A470JAT2A-AVX-datasheet-8398952.pdf?src-supplier=_legacy+Avnet; ComponentLink10URL: https://datasheet.octopart.com:443/06035A470JAT2A-AVX-datasheet-75321.pdf?src-supplier=Farnell; ComponentLink10Description: https://datasheet.octopart.com:443/06035A470JAT2A-AVX-datasheet-75321.pdf?src-supplier=Farnell; ComponentLink11URL: https://datasheet.octopart.com:443/06035A470JAT2A-AVX-datasheet-166051239.pdf?src-supplier=Amar+Radio+Corporation; ComponentLink11Description: https://datasheet.octopart.com:443/06035A470JAT2A-AVX-datasheet-166051239.pdf?src-supplier=Amar+Radio+Corporation; ComponentLink12URL: https://datasheet.octopart.com/06035A470JAT2A-AVX---Kyocera-datasheet-13516023.pdf; ComponentLink12Description: https://datasheet.octopart.com/06035A470JAT2A-AVX---Kyocera-datasheet-13516023.pdf; ComponentLink13URL: https://datasheet.octopart.com:443/06035A470JAT2A-AVX-datasheet-8446347.pdf?src-supplier=Future+Electronics; ComponentLink13Description: https://datasheet.octopart.com:443/06035A470JAT2A-AVX-datasheet-8446347.pdf?src-supplier=Future+Electronics; ComponentLink14URL: https://datasheet.octopart.com:443/06035A470JAT2A-AVX-datasheet-167032.pdf?src-supplier=Future+Electronics; ComponentLink14Description: https://datasheet.octopart.com:443/06035A470JAT2A-AVX-datasheet-167032.pdf?src-supplier=Future+Electronics; ComponentLink15URL: https://datasheet.octopart.com:443/06035A470JAT2A-AVX-datasheet-5379993.pdf?src-supplier=Garrett; ComponentLink15Description: https://datasheet.octopart.com:443/06035A470JAT2A-AVX-datasheet-5379993.pdf?src-supplier=Garrett; ComponentLink16URL: https://datasheet.octopart.com:443/06035A470JAT2A-AVX-datasheet-5383.pdf?src-supplier=Garrett; ComponentLink16Description: https://datasheet.octopart.com:443/06035A470JAT2A-AVX-datasheet-5383.pdf?src-supplier=Garrett; ComponentLink17URL: https://datasheet.octopart.com:443/06035A470JAT2A-AVX---Kyocera-datasheet-1421.pdf?src-supplier=TME; ComponentLink17Description: https://datasheet.octopart.com:443/06035A470JAT2A-AVX---Kyocera-datasheet-1421.pdf?src-supplier=TME; ComponentLink18URL: https://datasheet.octopart.com:443/06035A470JAT2A-AVX-datasheet-85393.pdf?src-supplier=RS+(Formerly+Allied+Electronics); ComponentLink18Description: https://datasheet.octopart.com:443/06035A470JAT2A-AVX-datasheet-85393.pdf?src-supplier=RS+(Formerly+Allied+Electronics); ComponentLink19URL: https://datasheet.octopart.com:443/06035A470JAT2A-AVX-datasheet-111405.pdf?src-supplier=Sierra+IC; ComponentLink19Description: https://datasheet.octopart.com:443/06035A470JAT2A-AVX-datasheet-111405.pdf?src-supplier=Sierra+IC; ComponentLink20URL: https://datasheet.octopart.com:443/06035A470JAT2A-AVX-datasheet-5039.pdf?src-supplier=DigiKey; ComponentLink20Description: https://datasheet.octopart.com:443/06035A470JAT2A-AVX-datasheet-5039.pdf?src-supplier=DigiKey; ComponentLink21URL: http://sigma.octopart.com:80/rohs_statement/Commercial-Surface-Mount-Chips---C0G-NP0-Dielectric-AVX-family-181.pdf?src-supplier=Compliance+Statements; ComponentLink21Description: http://sigma.octopart.com:80/rohs_statement/Commercial-Surface-Mount-Chips---C0G-NP0-Dielectric-AVX-family-181.pdf?src-supplier=Compliance+Statements; ComponentLink22URL: http://sigma.octopart.com:80/conflict_mineral_statement/AVX-company-34.pdf?src-supplier=Compliance+Statements; ComponentLink22Description: http://sigma.octopart.com:80/conflict_mineral_statement/AVX-company-34.pdf?src-supplier=Compliance+Statements; ComponentLink23URL: http://sigma.octopart.com:80/reach_statement/AVX-company-19.pdf?src-supplier=Compliance+Statements; ComponentLink23Description: http://sigma.octopart.com:80/reach_statement/AVX-company-19.pdf?src-supplier=Compliance+Statements